# EAGLE design Arduino Basic Sensor Board (EAGLE 7.5.0)
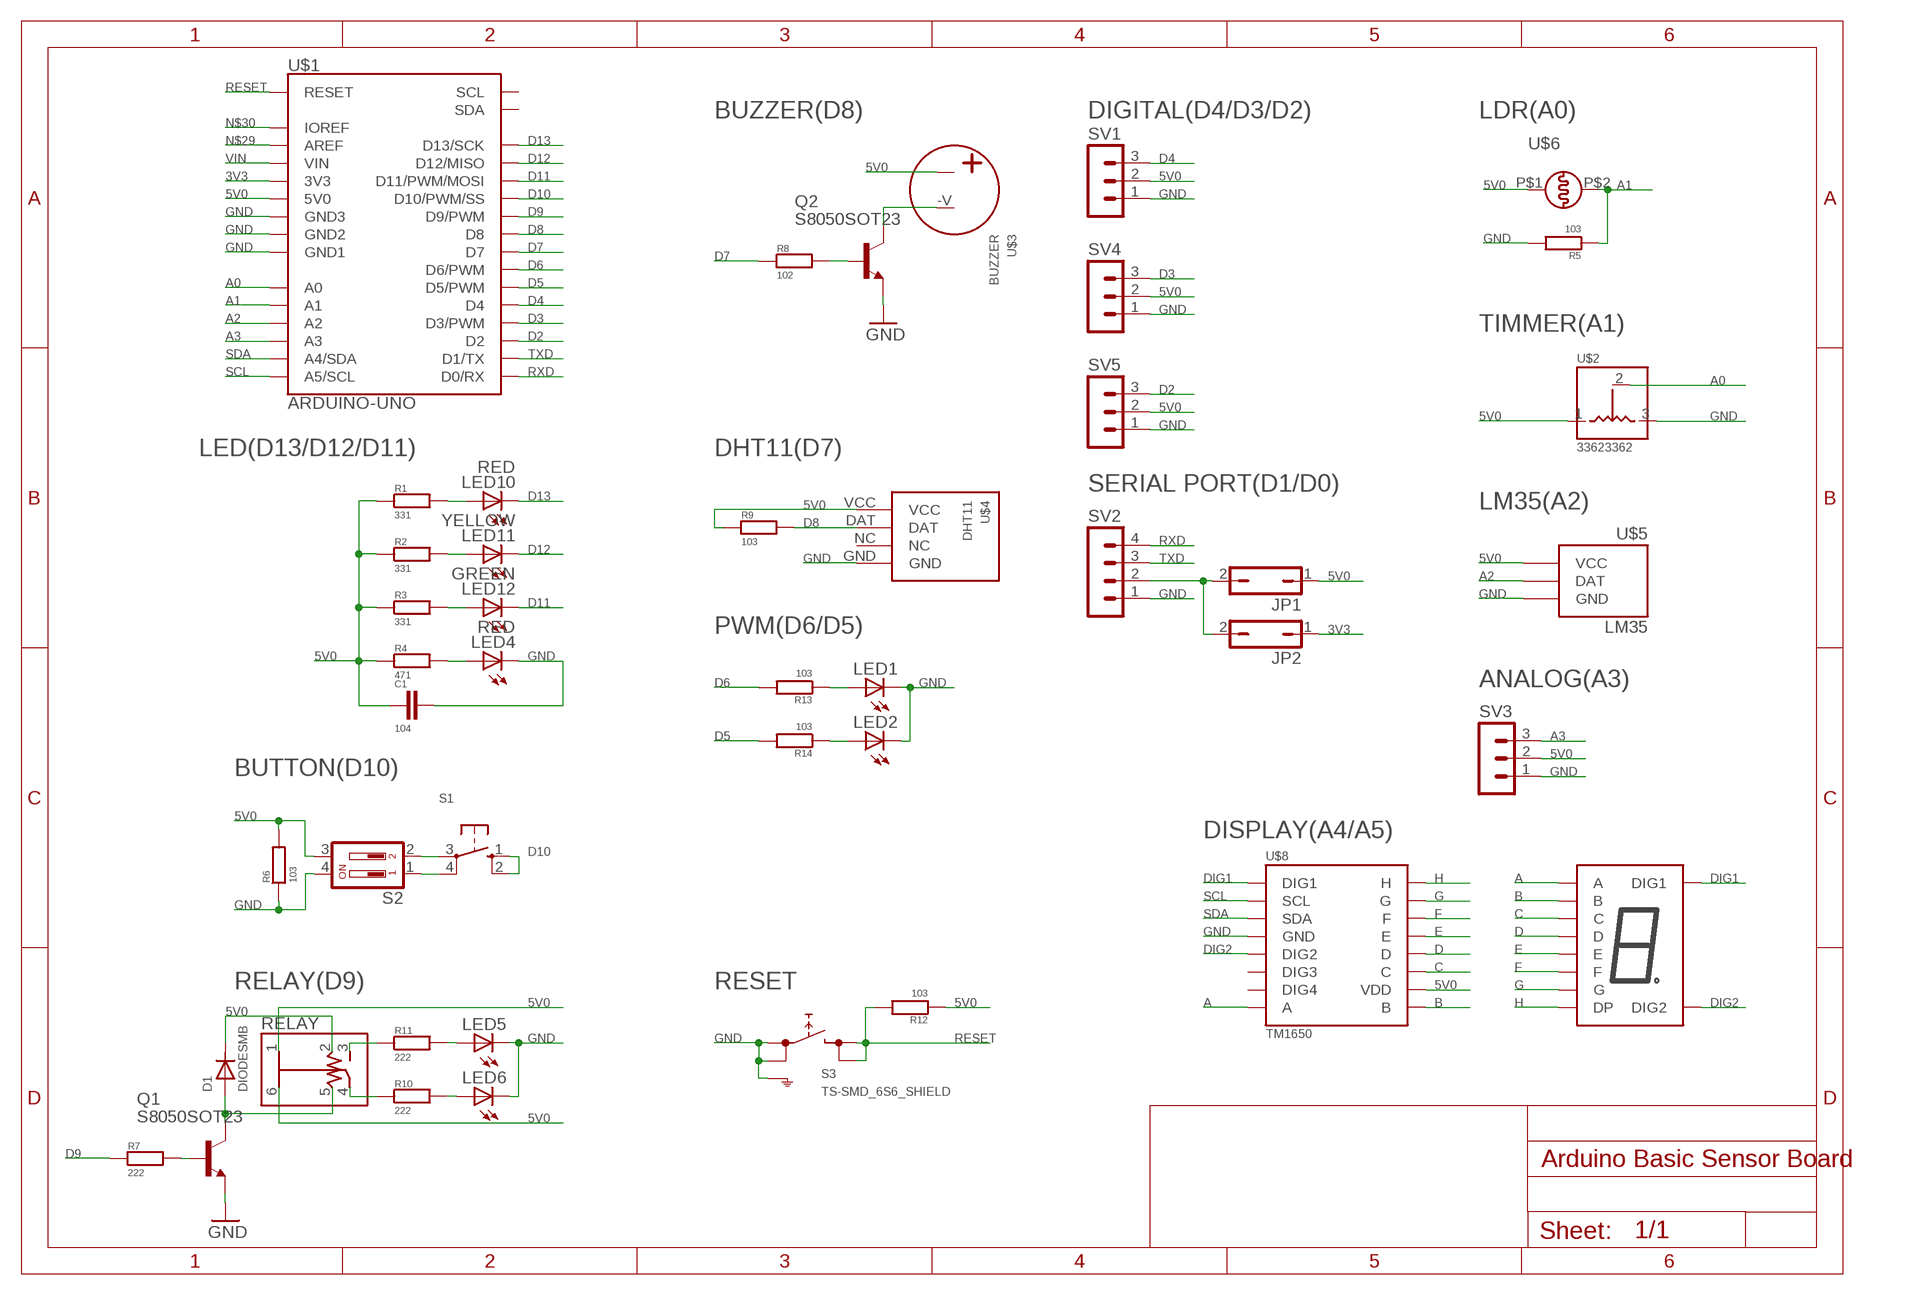
[diagram p0: schematic, sheet 1]

## Parts
C1  104  C0805  [C0805]
D1  DIODESMB  [SMB]
JP1  JP1Q  [JP1Q]
JP2  JP1Q  [JP1Q]
LED1  LEDCHIPLED_1206  [LED1206]
LED2  LEDCHIPLED_1206  [LED1206]
LED4  RED  LEDCHIPLED_0805  [LED0805]
LED5  LEDSML1206  [SML1206]
LED6  LEDSML1206  [SML1206]
LED10  RED  LEDSML1206  [SML1206]
LED11  YELLOW  LEDSML1206  [SML1206]
LED12  GREEN  LEDSML1206  [SML1206]
Q1  S8050SOT23  [SOT23]
Q2  S8050SOT23  [SOT23]
R1  331  R0805  [R0805]
R2  331  R0805  [R0805]
R3  331  R0805  [R0805]
R4  471  R0805  [R0805]
R5  103  R0805  [R0805]
R6  103  R0805  [R0805]
R7  222  R0805  [R0805]
R8  102  R0805  [R0805]
R9  103  R0805  [R0805]
R10  222  R0805  [R0805]
R11  222  R0805  [R0805]
R12  103  R0805  [R0805]
R13  103  R0805  [R0805]
R14  103  R0805  [R0805]
RELAY  RELAY-HK4100F-DC5V  [RELAY-HK4100F-DC5V]
S1  TS-DIP-4.54.5  [TS-DIP-4.5*4.5]
S2  SD4-02  [SD4-02]
S3  TS-SMD_6S6_SHIELD  [TS-SMD_6*6_SHIELD]
SV1  MA03-1  [MA03-1]
SV2  MA04-1  [MA04-1]
SV3  MA03-1  [MA03-1]
SV4  MA03-1  [MA03-1]
SV5  MA03-1  [MA03-1]
U$1  ARDUINO-UNO  [ARDUINO-UNO]
U$2  33623362  [3362]
U$3  BUZZER  [BUZZER]
U$4  DHT11  [DHT11]
U$5  LM35  [TO92]
U$6  LDR  [LDR]
U$8  TM1650  [SO16]
U$15  3261AS  [TN_AS_2_0.36INCH]

## Nets
3V3: JP2.1 U$1.3V3
5V0: C1.2 D1.1 JP1.1 R1.1 R2.1 R3.1 R4.1 R6.2 R9.1 R12.1 RELAY.1 RELAY.2 RELAY.6 S2.3 SV1.2 SV3.2 SV4.2 SV5.2 U$1.5V0 U$2.1 U$3.+V U$4.VCC U$5.1(VCC) U$6.P$1 U$8.10(VDD)
A: U$8.8(A) U$15.3(A)
A0: U$1.A0 U$2.2
A1: R5.1 U$1.A1 U$6.P$2
A2: U$1.A2 U$5.2(DAT)
A3: SV3.3 U$1.A3
B: U$8.9(B) U$15.9(B)
C: U$8.11(C) U$15.8(C)
D: U$8.12(D) U$15.6(D)
D2: SV5.3 U$1.D2
D3: SV4.3 U$1.D3(D3/PWM)
D4: SV1.3 U$1.D4
D5: R14.2 U$1.D5(D5/PWM)
D6: R13.2 U$1.D6(D6/PWM)
D7: R8.1 U$1.D7
D8: R9.2 U$1.D8 U$4.DAT
D9: R7.1 U$1.D9(D9/PWM)
D10: S1.1(S) S1.2(S1) U$1.D10(D10/PWM/SS)
D11: LED12.C U$1.D11(D11/PWM/MOSI)
D12: LED11.C U$1.D12(D12/MISO)
D13: LED10.C U$1.D13(D13/SCK)
DIG1: U$8.1(DIG1) U$15.10(DIG1)
DIG2: U$8.5(DIG2) U$15.5(DIG2)
E: U$8.13(E) U$15.7(E)
F: U$8.14(F) U$15.4(F)
G: U$8.15(G) U$15.1(G)
GND: C1.1 LED1.C LED2.C LED4.C LED5.C LED6.C Q1.E Q2.E R5.2 R6.1 S2.4 S3.1(1.1) S3.2(1.2) S3.5(SH) SV1.1 SV2.1 SV3.1 SV4.1 SV5.1 U$1.GND1 U$1.GND2 U$1.GND3 U$2.3 U$4.GND U$5.3(GND) U$8.4(GND)
H: U$8.16(H) U$15.2(DP)
N$1: LED10.A R1.2
N$2: LED11.A R2.2
N$3: LED12.A R3.2
N$4: LED4.A R4.2
N$5: S1.4(P1) S2.1
N$6: S1.3(P) S2.2
N$7: LED1.A R13.1
N$8: R10.1 RELAY.4
N$9: R11.1 RELAY.3
N$10: LED6.A R10.2
N$11: LED5.A R11.2
N$12: LED2.A R14.1
N$13: JP1.2 JP2.2 SV2.2
N$29: U$1.AREF
N$30: U$1.REF(IOREF)
N$32: D1.2 Q1.C RELAY.5
N$33: Q1.B R7.2
N$34: Q2.B R8.2
N$35: Q2.C U$3.-V
RESET: R12.2 S3.3(2.1) S3.4(2.2) U$1.RST(RESET)
RXD: SV2.4 U$1.D0(D0/RX)
SCL: U$1.A5(A5/SCL) U$8.2(SCL)
SDA: U$1.A4(A4/SDA) U$8.3(SDA)
TXD: SV2.3 U$1.D1(D1/TX)
VIN: U$1.VIN
Unconnected: U$1.SCL U$1.SDA U$4.NC U$8.6(DIG3) U$8.7(DIG4)

## Notes on the sheet
- BUZZER(D8) | DIGITAL(D4/D3/D2) | LDR(A0)
- TIMMER(A1)
- LED(D13/D12/D11) | DHT11(D7)
- SERIAL PORT(D1/D0)
- LM35(A2)
- PWM(D6/D5)
- ANALOG(A3)
- BUTTON(D10)
- DISPLAY(A4/A5)
- RELAY(D9) | RESET

## Library data of the parts
C1 = RCLDA:C: CAPACITOR
D1 = RCLDA:DIODE: DIODE
JP1 JP2 = Jumper:JP1Q: JUMPER
LED1 LED2 LED4-LED6 LED10-LED12 = Display:LED
Q1 Q2 = RCLDA:S8050: NPN Transistor
R1-R14 = RCLDA:R: RESISTOR
RELAY = Senser:RELAY-HK4100F-DC5V
S1 = Button:TS-DIP-4.5*4.5: OMRON SWITCH; MPN: B3F-1000; OC_FARNELL: 176432; OC_NEWARK: 36M3542
S2 = Switch:SD4-02: DIL/CODE SWITCH; OC_FARNELL: unknown; OC_NEWARK: unknown
S3 = Button:TS-SMD_6*6_SHIELD: 6.2 X 6.5mm TACT Switch (SMD) Source: http://www3.alps.co.jp/WebObjects/catalog.woa/PDF/E/Switch/Tact/SKHM/SKHM.PDF
SV1 SV3-SV5 = Pin-Header:MA03-1: PIN HEADER; OC_FARNELL: unknown; OC_NEWARK: unknown
SV2 = Pin-Header:MA04-1: PIN HEADER; OC_FARNELL: unknown; OC_NEWARK: unknown
U$1 = Module:ARDUINO-UNO
U$2 = Senser:3362
U$3 = Senser:BUZZER
U$4 = Senser:DHT11
U$5 = Senser:LM35
U$6 = Senser:LDR
U$8 = Chip:TM1650
U$15 = Display:3261AS

## Board
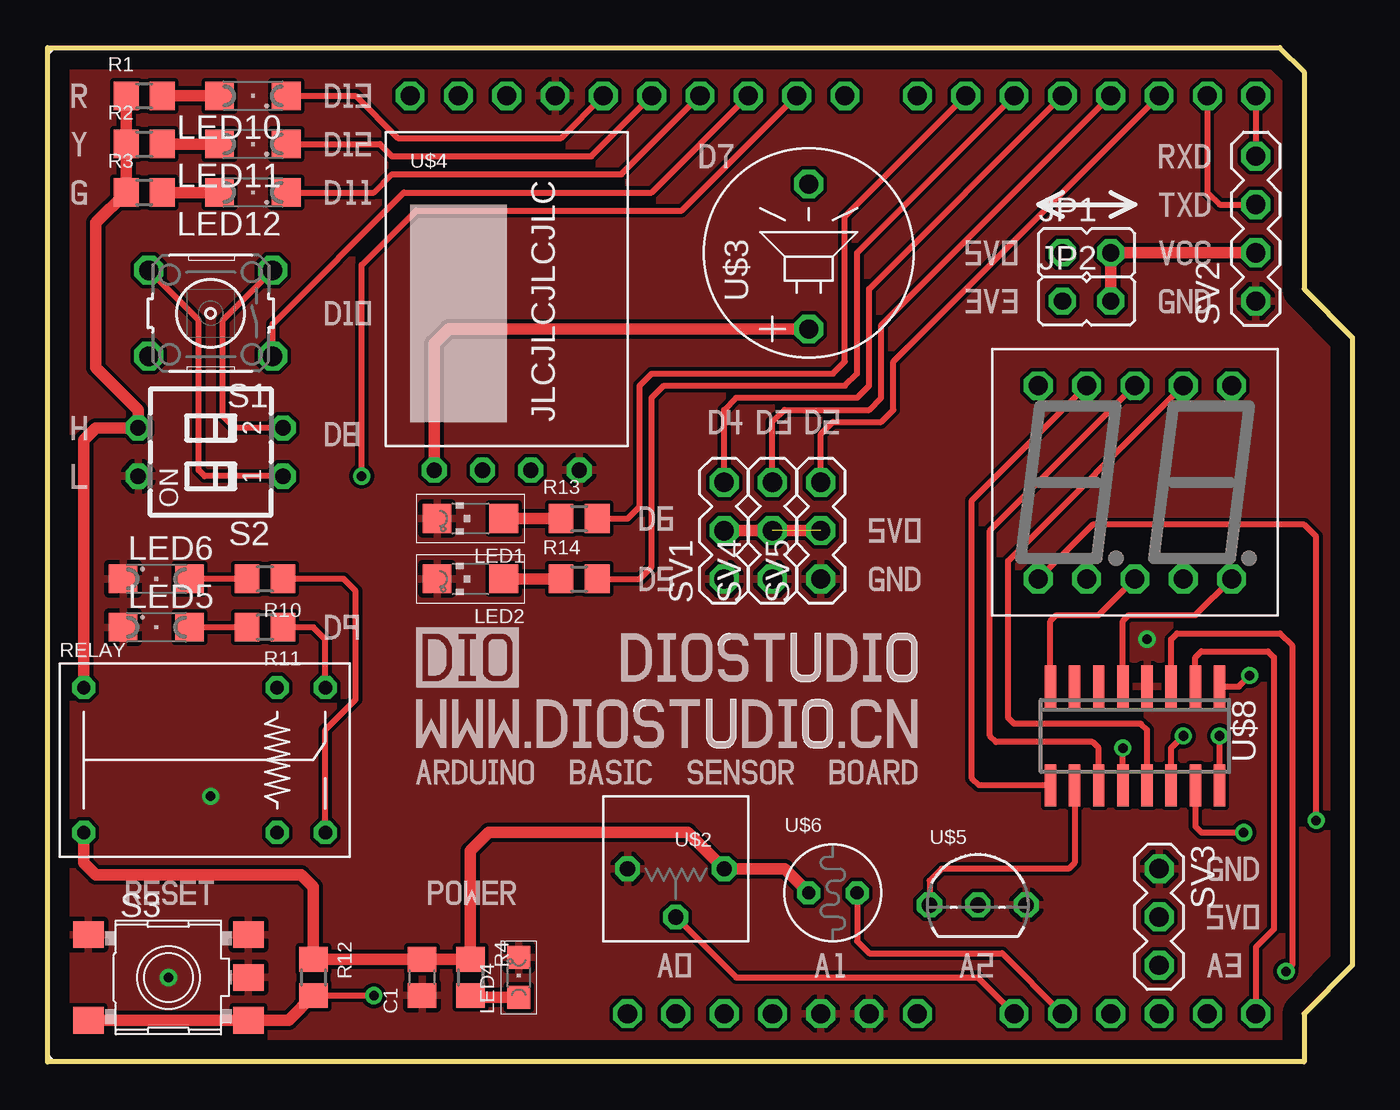
[diagram p1: board, top side]
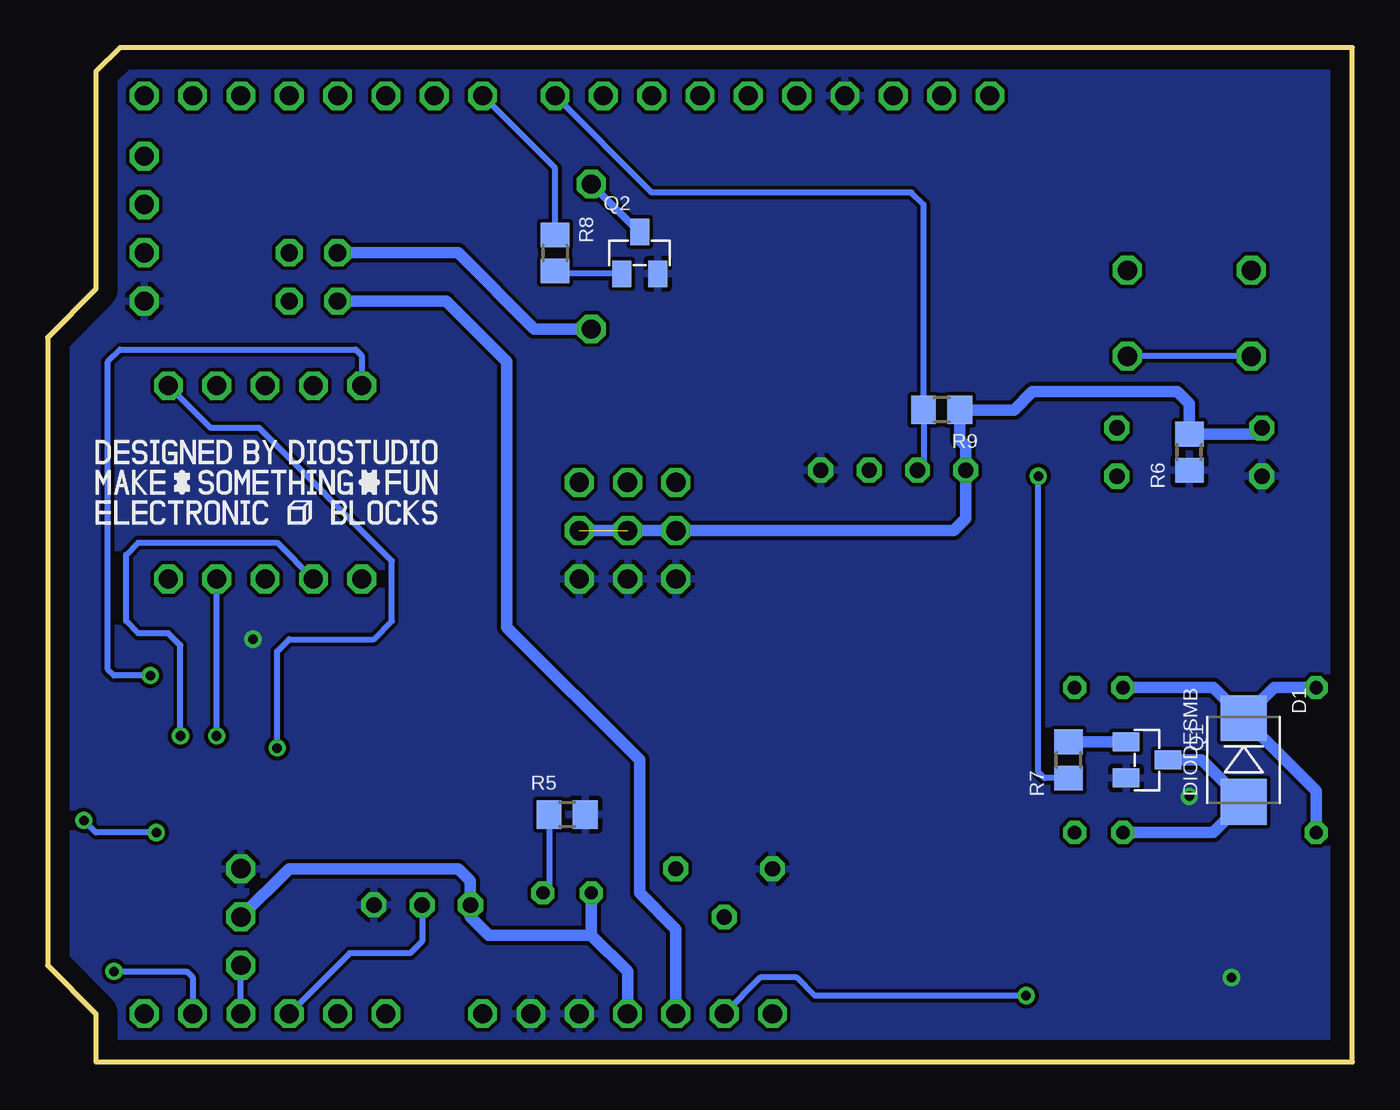
[diagram p2: board, bottom side, seen from below]

Size 68.58 x 53.34 mm. Coordinates in mm from the lower left corner, seen from the top.
Outline: 0,0 0,53.34 64.77,53.34 66.04,52.07 66.04,40.64 68.58,38.1 68.58,5.08 66.04,2.54 66.04,0 0,0
Copper layers (1*16): Top 0.035mm / dielectric 1.5mm / Bottom 0.035mm
Design rules "default": minimum track width 10mil, minimum drill 24mil, track to track 8mil, track to pad 8mil, pad to pad 8mil, via to via 8mil, smd to smd 8mil, copper to edge 40mil, drill to drill 8mil, minimum pad ring 10mil, minimum via ring 8mil, stop-mask expansion 4mil, vias tented up to drill 0mil, thermal gap 10mil

### Footprints (pad centres in the part's own frame; a part is rotated, then mirrored left to right if it is on the bottom)
C0805 = smd 1.3 x 1.5: 1 -0.95,0; 2 0.95,0
SMB = smd 2.4 x 2.4: 1 -2.2,0; 2 2.2,0
JP1Q = drill 0.914 octagon: 1 0,-1.27; 2 0,1.27
LED1206 = smd 1.5 x 1.5: A -1.75,0; C 1.75,0
LED0805 = smd 1.2 x 1.2: A -1.05,0; C 1.05,0
SML1206 = smd 1.5 x 1.5: A 1.75,0; C -1.75,0
SOT23 = smd 1 x 1.4: B -0.95,-1.1; C 0,1.1; E 0.95,-1.1
R0805 = smd 1.3 x 1.5: 1 -0.95,0; 2 0.95,0
RELAY-HK4100F-DC5V = drill 0.7 octagon: 1 -6.35,3.81; 2 3.81,3.81; 3 6.35,3.81; 4 6.35,-3.81; 5 3.81,-3.81; 6 -6.35,-3.81
TS-DIP-4.5*4.5 = drill 1.016 octagon: 1 -3.251,2.261; 2 3.251,2.261; 3 -3.251,-2.261; 4 3.251,-2.261
SD4-02 = drill 0.813 octagon: 1 -1.27,-3.81; 2 1.27,-3.81; 3 1.27,3.81; 4 -1.27,3.81
TS-SMD_6*6_SHIELD = smd 1.6 x 1.4: 1 -4.2,2.25; 2 4.2,2.25; 3 -4.2,-2.25; 4 4.2,-2.25; 5 4.2,0
MA03-1 = drill 1.016 octagon: 1 -2.54,0; 2 0,0; 3 2.54,0
MA04-1 = drill 1.016 octagon: 1 -3.81,0; 2 -1.27,0; 3 1.27,0; 4 3.81,0
ARDUINO-UNO = drill 1 octagon: 3V3 35.56,2.54; 5V0 38.1,2.54; A0 50.8,2.54; A1 53.34,2.54; A2 55.88,2.54; A3 58.42,2.54; A4 60.96,2.54; A5 63.5,2.54; AREF 24.13,50.8; D0 63.5,50.8; D1 60.96,50.8; D2 58.42,50.8; D3 55.88,50.8; D4 53.34,50.8; D5 50.8,50.8; D6 48.26,50.8; D7 45.72,50.8; D8 41.91,50.8; D9 39.37,50.8; D10 36.83,50.8; D11 34.29,50.8; D12 31.75,50.8; D13 29.21,50.8; GND1 26.67,50.8; GND2 43.18,2.54; GND3 40.64,2.54; REF 30.48,2.54; RST 33.02,2.54; SCL 19.05,50.8; SDA 21.59,50.8; VIN 45.72,2.54
3362 = drill 0.8 octagon: 1 -2.54,0; 2 0,2.54; 3 2.54,0
BUZZER = drill 1 octagon: +V -4,0; -V 3.62,0
DHT11 = drill 0.8 octagon: DAT -1.27,-10.16; GND 3.81,-10.16; NC 1.27,-10.16; VCC -3.81,-10.16
TO92 = drill 0.813 octagon: 1 -2.54,0; 2 0,0; 3 2.54,0
LDR = drill 0.7 octagon: P$1 0,0; P$2 2.54,0
SO16 = smd 0.6 x 2.2: 1 -4.445,-2.6; 2 -3.175,-2.6; 3 -1.905,-2.6; 4 -0.635,-2.6; 5 0.635,-2.6; 6 1.905,-2.6; 7 3.175,-2.6; 8 4.445,-2.6; 9 4.445,2.6; 10 3.175,2.6; 11 1.905,2.6; 12 0.635,2.6; 13 -0.635,2.6; 14 -1.905,2.6; 15 -3.175,2.6; 16 -4.445,2.6
TN_AS_2_0.36INCH = drill 1 octagon: 1 -5.08,-5.08; 2 -2.54,-5.08; 3 0,-5.08; 4 2.54,-5.08; 5 5.08,-5.08; 6 5.08,5.08; 7 2.54,5.08; 8 0,5.08; 9 -2.54,5.08; 10 -5.08,5.08

### Placement (x,y rotation side)
C1  19.69,4.45 90 top
D1  5.71,15.88 270 bottom
JP1  54.61,42.55 270 top
JP2  54.61,40.01 270 top
LED1  22.23,28.58 180 top
LED2  22.23,25.4 180 top
LED4  24.77,4.45 90 top
LED5  5.71,22.86 0 top
LED6  5.71,25.4 0 top
LED10  10.79,50.8 180 top
LED11  10.79,48.26 180 top
LED12  10.79,45.72 180 top
Q1  10.79,15.88 270 bottom
Q2  37.47,42.55 0 bottom
R1  5.08,50.8 0 top
R2  5.08,48.26 0 top
R3  5.08,45.72 0 top
R4  22.23,4.45 270 top
R5  41.27,13.02 0 bottom
R6  8.57,32.07 90 bottom
R7  14.92,15.88 90 bottom
R8  41.91,42.55 270 bottom
R9  21.59,34.29 180 bottom
R10  11.43,25.4 180 top
R11  11.43,22.86 180 top
R12  13.97,4.45 270 top
R13  27.94,28.58 0 top
R14  27.94,25.4 0 top
RELAY  8.25,15.88 0 top
S1  8.57,39.37 180 top
S2  8.57,32.07 90 top
S3  6.35,4.45 0 top
SV1  35.56,27.94 90 top
SV2  63.5,43.81 90 top
SV3  58.42,7.62 270 top
SV4  38.1,27.94 90 top
SV5  40.64,27.94 90 top
U$1  0,0 0 top
U$2  33.02,10.16 180 top
U$3  40,42.55 90 top
U$4  24.13,41.28 0 top
U$5  48.9,8.26 0 top
U$6  40,8.89 0 top
U$7  [5V0_050]  48.26,41.91 0 top
U$8  57.15,17.15 180 top
U$9  [D11_050]  14.61,45.09 0 top
U$10  [ARDUINO_BASIC_SENSOR_BOARD_050]  19.37,14.61 0 top
U$11  [D10_050]  14.61,38.73 0 top
U$12  [D13_050]  14.61,50.17 0 top
U$13  [POWER_050]  20,8.26 0 top
U$14  [RESET_050]  4.13,8.26 0 top
U$15  57.15,30.48 0 top
U$16  [D4_050]  34.77,33.02 0 top
U$17  [GND_050]  60.96,9.53 0 top
U$18  [RXD_050]  58.42,46.99 0 top
U$19  [GND_050]  58.42,39.37 0 top
U$20  [TXD_050]  58.42,44.45 0 top
U$21  [HIGH_050]  1.27,32.7 0 top
U$22  [LOW_050]  1.27,30.16 0 top
U$23  [D3_050]  37.31,33.02 0 top
U$24  [D2_050]  39.85,33.02 0 top
U$25  [D5_050]  31.11,24.77 0 top
U$26  [5V0_050]  60.96,6.98 0 top
U$27  [A3_050]  60.96,4.45 0 top
U$28  [LOGO_100]  19.37,19.69 0 top
U$29  [DIOSTUDIO_100]  30.16,20 0 top
U$30  [WWW.DIOSTUDIO.CN_100]  19.37,16.51 0 top
U$31  [D12_050]  14.61,47.62 0 top
U$32  [D6_050]  31.11,27.94 0 top
U$33  [D8_050]  14.61,32.39 0 top
U$34  [D9_050]  14.61,22.23 0 top
U$35  [D7_050]  34.29,46.99 0 top
U$36  [A0_050]  32.07,4.45 0 top
U$37  [A1_050]  40.32,4.45 0 top
U$38  [A2_050]  47.94,4.45 0 top
U$39  [MAKE_SOMETHING_FUN_050]  66.04,28.26 0 bottom
U$40  [5V0_050]  43.18,27.3 0 top
U$41  [GND_050]  43.18,24.77 0 top
U$42  [VCC_050]  58.42,41.91 0 top
U$43  [3V3_050]  48.26,39.37 0 top
U$44  [GREEN_050]  1.27,45.09 0 top
U$45  [RED_050]  1.27,50.17 0 top
U$46  [YELLOW_050]  1.27,47.62 0 top

### Tracks (layer width: path | path; a pad name or v marks a point on that pad's centre or on a via)
3V3
  Bottom 0.61: U$1.3V3 35.56,6.98 37.47,8.89 37.47,15.88 44.45,22.86 44.45,36.83 47.62,40.01 JP2.1
5V0  (1 unrouted)
  Top 0.305: U$8.10 53.98,10.48 53.66,10.16 46.99,10.16 46.35,9.53 U$5.1
  Top 0.61: RELAY.6 1.9,10.48 2.54,9.84 13.33,9.84 13.97,9.21 R12.1 C1.2 R4.1 22.23,11.11 23.18,12.07 33.66,12.07 U$2.1 38.73,10.16 U$6.P$1 | RELAY.1 1.9,32.7 2.54,33.34 S2.3 4.76,34.29 2.54,36.51 2.54,44.13 R3.1 R2.1 R1.1 | U$3.+V 21.08,38.55 20.32,37.78 U$4.VCC | SV1.2 SV5.2
  Bottom 0.61: RELAY.6 1.9,14.27 D1.1 | RELAY.1 4.1,19.69 D1.1 | RELAY.2 7.32,19.69 D1.1 | U$1.5V0 38.1,4.76 40,6.67 | 40,6.67 U$6.P$1 | 40,6.67 45.4,6.67 46.35,7.62 U$5.1 46.35,9.53 46.99,10.16 55.88,10.16 SV3.2 | S2.3 5.08,33.02 R6.2 8.57,34.61 9.21,35.24 16.83,35.24 17.78,34.29 R9.1 20.64,32.7 20.32,32.39 U$4.VCC 20.32,28.58 20.95,27.94 SV1.2 SV5.2 | U$3.+V 42.99,38.55 46.99,42.55 JP1.1
A
  Top 0.305: U$8.8 52.7,23.18 53.02,23.5 55.24,23.5 U$15.3
A0
  Top 0.305: U$2.2 36.2,4.45 48.9,4.45 U$1.A0
A1
  Top 0.305: U$6.P$2 42.55,6.35 43.18,5.72 50.16,5.72 U$1.A1
  Bottom 0.305: R5.1 42.23,9.21 U$6.P$2
A2
  Bottom 0.305: U$5.2 48.9,6.35 49.53,5.72 52.7,5.72 U$1.A2
A3
  Bottom 0.305: U$1.A3 SV3.3
B
  Top 0.305: U$15.9 48.58,29.53 48.58,14.92 48.95,14.55 U$8.9
C
  Top 0.305: U$8.11 55.24,16.51 54.93,16.83 49.85,16.83 49.53,17.15 49.53,27.94 U$15.8
D  (via drill 0.5)
  Top 0.305: U$8.12 v56.52,16.51
  Bottom 0.305: v56.52,16.51 56.52,21.59 55.88,22.23 51.44,22.23 50.48,23.18 50.48,26.35 57.47,33.34 60.01,33.34 U$15.6
D2
  Top 0.305: SV5.3 40.64,33.02 41.27,33.66 43.81,33.66 44.45,34.29 44.45,36.83 U$1.D2
D3
  Top 0.305: SV4.3 38.1,33.66 38.73,34.29 43.18,34.29 43.81,34.93 43.81,38.73 U$1.D3
D4
  Top 0.305: SV1.3 35.56,34.29 36.2,34.93 42.55,34.93 43.18,35.56 43.18,40.64 U$1.D4
D5
  Top 0.305: R14.2 31.11,25.4 31.75,26.04 31.75,34.93 32.38,35.56 41.91,35.56 42.55,36.2 42.55,42.55 U$1.D5
D6
  Top 0.305: R13.2 30.48,28.58 31.11,29.21 31.11,35.56 31.75,36.2 41.27,36.2 41.91,36.83 41.91,44.45 U$1.D6
D7
  Bottom 0.305: R8.1 41.91,46.99 U$1.D7
D8
  Bottom 0.305: U$4.DAT 22.54,31.44 R9.2 22.54,45.08 23.18,45.72 36.83,45.72 U$1.D8
D9  (via drill 0.5)
  Top 0.305: v16.51,30.8 16.51,41.91 19.37,44.77 33.34,44.77 U$1.D9
  Bottom 0.305: R7.1 16.2,14.93 16.51,15.24 v16.51,30.8
D10
  Top 0.305: S1.1 11.82,38.81 18.73,45.72 31.75,45.72 U$1.D10
  Bottom 0.305: S1.2 S1.1
D11
  Top 0.305: LED12.C 17.14,45.72 18.1,46.67 30.16,46.67 U$1.D11
D12
  Top 0.305: LED11.C 17.46,48.26 18.1,47.62 28.57,47.62 U$1.D12
D13
  Top 0.305: LED10.C 16.19,50.8 18.41,48.58 26.99,48.58 U$1.D13
DIG1  (via drill 0.5)
  Top 0.305: U$8.1 62.61,19.75 v63.18,20.32
  Bottom 0.305: v63.18,20.32 65.09,20.32 65.41,20.64 65.41,36.83 64.77,37.47 52.39,37.47 52.07,37.15 U$15.10
DIG2
  Top 0.305: U$8.5 56.52,23.18 56.83,23.5 60.33,23.5 U$15.5
E
  Top 0.305: U$8.13 57.78,17.46 57.47,17.78 50.8,17.78 50.48,18.1 50.48,26.35 U$15.7
F  (via drill 0.5)
  Top 0.305: U$8.14 59.05,16.51 v59.69,17.15
  Bottom 0.305: v59.69,17.15 U$15.4
G  (via drill 0.5)
  Top 0.305: U$8.15 60.33,12.38 60.64,12.07 v62.87,12.07 | v66.67,12.7 66.67,27.62 66.04,28.26 54.93,28.26 U$15.1
  Bottom 0.305: v62.87,12.07 66.04,12.07 v66.67,12.7
GND  (via drill 0.5)
  other vias: 8.57,13.97 6.35,4.45 57.78,22.23
  pour Top: 0,0 0,53.34 64.77,53.34 66.04,52.07 66.04,40.64 68.58,38.1 68.58,5.08 66.04,2.54 66.04,0
  pour Bottom: 0,0 0,53.34 64.77,53.34 66.04,52.07 66.04,40.64 68.58,38.1 68.58,5.08 66.04,2.54 66.04,0
H  (via drill 0.5)
  Top 0.305: U$8.16 v61.59,17.15
  Bottom 0.305: v61.59,17.15 61.59,21.91 62.23,22.54 63.82,22.54 64.45,23.18 64.45,26.67 63.82,27.3 56.52,27.3 U$15.2
N$1
  Top 0.61: R1.2 LED10.A
N$2
  Top 0.61: R2.2 LED11.A
N$3
  Top 0.61: R3.2 LED12.A
N$4
  Top 0.61: LED4.A 22.32,3.4 R4.2
N$5
  Top 0.305: S2.1 8.25,30.8 7.94,31.12 7.94,39.01 S1.4
N$6
  Top 0.305: S2.2 9.84,33.34 9.21,33.97 9.21,39.01 S1.3
N$7
  Top 0.61: R13.1 LED1.A
N$8
  Top 0.305: RELAY.4 14.61,17.46 16.19,19.05 16.19,24.77 15.56,25.4 R10.1
N$9
  Top 0.305: RELAY.3 14.61,22.23 13.97,22.86 R11.1
N$10
  Top 0.305: R10.2 LED6.A
N$11
  Top 0.305: R11.2 LED5.A
N$12
  Top 0.61: R14.1 LED2.A
N$13
  Top 0.61: JP2.2 JP1.2 SV2.2
N$32
  Bottom 0.61: Q1.C 7.91,15.88 D1.2 7.32,12.07 RELAY.5
N$33
  Bottom 0.61: Q1.B R7.2
N$34
  Bottom 0.305: Q2.B 41.76,41.45 R8.2
N$35
  Bottom 0.406: Q2.C 37.48,43.65 U$3.-V
RESET  (via drill 0.5)
  Top 0.305: R12.2 v17.14,3.5 v17.14,3.49
  Top 0.61: S3.3 S3.4 12.67,2.2 R12.2
  Bottom 0.305: v17.14,3.49 28.26,3.49 29.21,4.45 31.11,4.45 U$1.RST
RXD
  Top 0.305: U$1.D0 SV2.4
SCL
  Top 0.305: U$8.2 60.33,21.27 60.64,21.59 64.13,21.59 64.45,21.27 64.45,6.98 63.5,6.03 U$1.A5
SDA  (via drill 0.5)
  Top 0.305: U$8.3 59.05,22.23 59.37,22.54 64.77,22.54 65.41,21.91 65.41,5.08 v65.09,4.76
  Bottom 0.305: v65.09,4.76 61.28,4.76 60.96,4.45 U$1.A4
TXD
  Top 0.305: U$1.D1 60.96,45.72 61.59,45.09 SV2.3

### Text on the board
tPlace: JLCJLCJLCJLC